# Altium project V1_HOZARI.PrjPcb
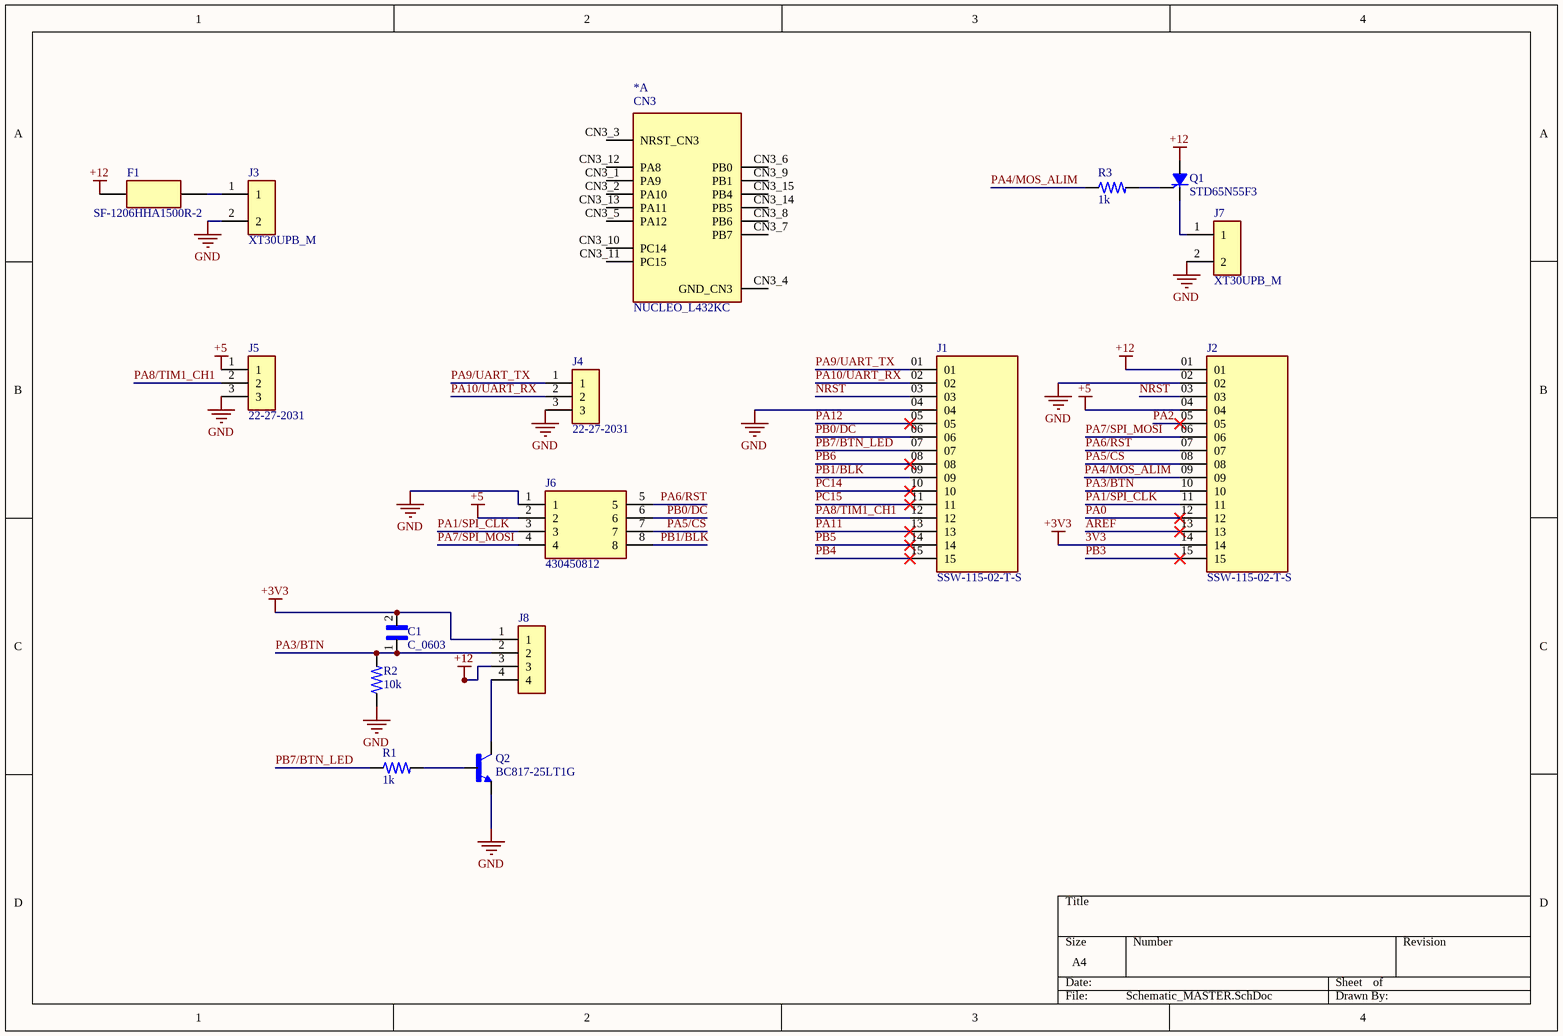
[diagram p0: Schematic_MASTER.SchDoc]
1 sheet, 16 parts. Net scope: global (net labels, ports and power ports of the same name join across sheets).
Board files: PCB_rond.PcbDoc, PCB_V1.PcbDoc

## Sheet Schematic_MASTER.SchDoc
size A4

### Parts
*  NUCLEO_L432KC  [NUCLEO_L432KC]  (part A of 2)
C1  C_0603  [C_0603]
F1  SF-1206HHA1500R-2  [SF-1206HHA1500R-2]
J1  SSW-115-02-T-S  [SSW-115-02-T-S]
J2  SSW-115-02-T-S  [SSW-115-02-T-S]
J3  XT30UPB_M  [XT30UPB-M]
J4  22-27-2031  [22-27-2031]
J5  22-27-2031  [22-27-2031]
J6  430450812  [430450812]
J7  XT30UPB_M  [XT30UPB-M]
J8  22-27-2041  [22-27-2041]  (value not drawn)
Q1  STD65N55F3  [STD65N55F3]
Q2  BC817-25LT1G  [SOT_BC817]
R1  1k  [R_0603]
R2  10k  [R_0603]
R3  1k  [R_0603]

### Nets
3V3: C1.2 J2.14 J8.1  [also labelled +3V3]
+5: J2.04 J5.1 J6.2
+12: F1.1 J2.01 J8.3 Q1.2(A)
GND: J1.04 J2.02 J3.2 J4.3 J5.3 J6.1 J7.2 Q2.2(E) R2.1
AREF: J2.13
NRST: J1.03 J2.03
PA0: J2.12
PA1/SPI_CLK: J2.11 J6.3
PA2: J2.05
PA3/BTN: C1.1 J2.10 J8.2 R2.2
PA4/MOS_ALIM: J2.09 R3.1
PA5/CS: J2.08 J6.7
PA6/RST: J2.07 J6.5
PA7/SPI_MOSI: J2.06 J6.4
PA8/TIM1_CH1: J1.12 J5.2
PA9/UART_TX: J1.01 J4.1
PA10/UART_RX: J1.02 J4.2
PA11: J1.13
PA12: J1.05
PB0/DC: J1.06 J6.6
PB1/BLK: J1.09 J6.8
PB3: J2.15
PB4: J1.15
PB5: J1.14
PB6: J1.08
PB7/BTN_LED: J1.07 R1.1
PC14: J1.10
PC15: J1.11
NetF1_2: F1.2 J3.1
NetJ7_1: J7.1 Q1.3(K)
NetJ8_4: J8.4 Q2.3(C)
NetQ1_1: Q1.1(G) R3.2
NetQ2_1: Q2.1(B) R1.2

Not connected (* = marked no-connect by the designer): * CN3_1(PA9) CN3_2(PA10) CN3_3(NRST_CN3) CN3_4(GND_CN3) CN3_5(PA12) CN3_6(PB0) CN3_7(PB7) CN3_8(PB6) CN3_9(PB1) CN3_10(PC14) CN3_11(PC15) CN3_12(PA8) CN3_13(PA11) CN3_14(PB5) CN3_15(PB4)

### Notes on the sheet
- (in symbol NUCLEO_L432KC, part A) CN3

### Library data of the parts
C1 = C_0603: SMD capacitor 0603; Value: *
Q2 = BC817-25LT1G: Transistor NPN 45V 0.5A hfe160 SOT23 | ON Semiconductor BC817-25LT1G; SnapEDA_Link: https://www.snapeda.com/parts/BC817-25LT1G/Onsemi/view-part/?ref=snap; Package: SOT-23-3 ON Semiconductor; Value: *; MF: ON Semiconductor; MP: BC817-25LT1G; Check_prices: https://www.snapeda.com/parts/BC817-25LT1G/Onsemi/view-part/?ref=eda
R1-R3 = R_0603: Res 0603